# EAGLE design Mother_Board (EAGLE 7.5.0)
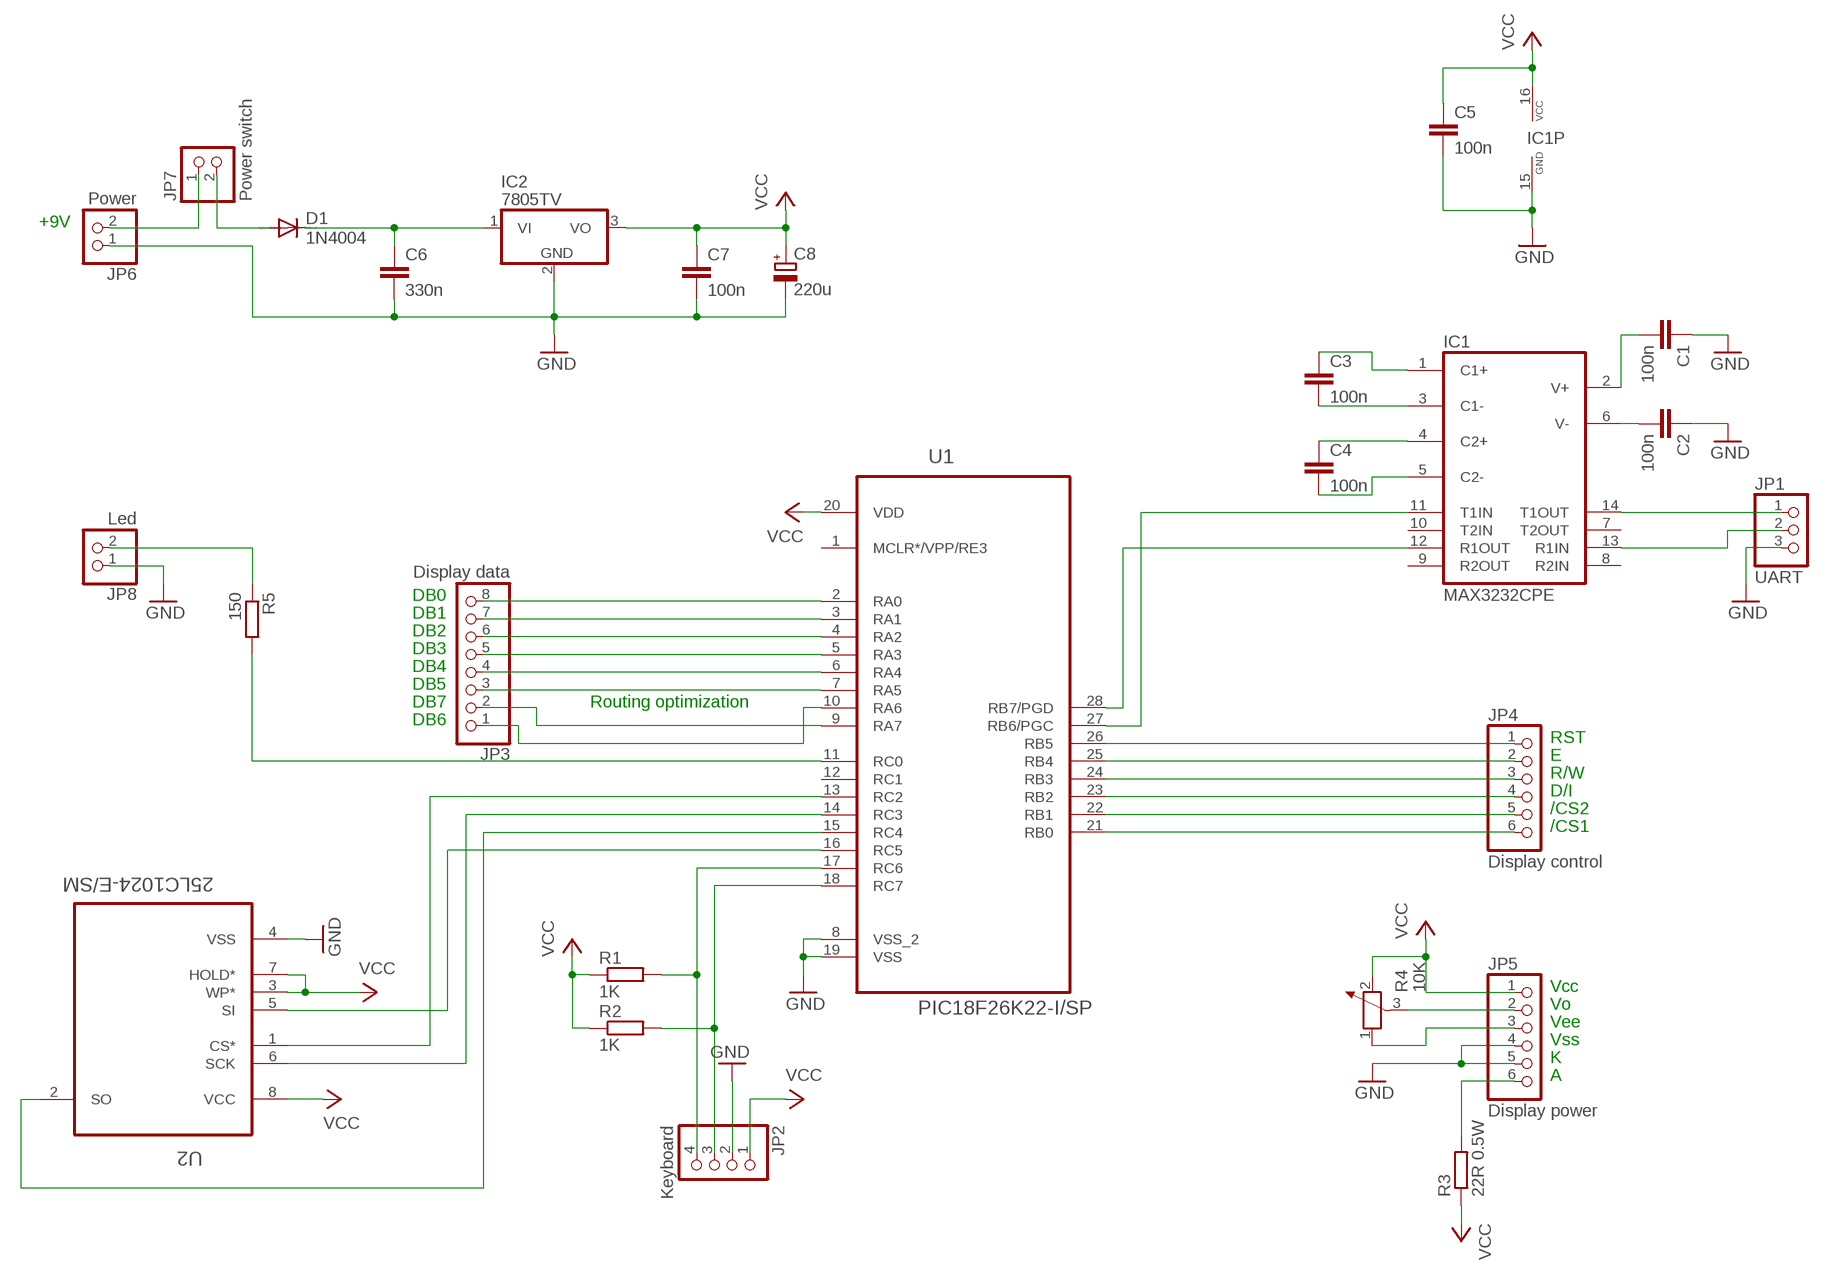
[diagram p0: schematic, sheet 1]

## Parts
C1  100n  C-EU025-030X050  [C025-030X050]
C2  100n  C-EU025-030X050  [C025-030X050]
C3  100n  C-EU025-030X050  [C025-030X050]
C4  100n  C-EU025-030X050  [C025-030X050]
C5  100n  C-EU025-030X050  [C025-030X050]
C6  330n  C-EU025-050X050  [C025-050X050]
C7  100n  C-EU025-030X050  [C025-030X050]
C8  220u  CPOL-EUB45181A  [B45181A]
D1  1N4004  [DO41-10]
IC1  MAX3232CPE  [DIL16]
IC2  7805TV  [TO220V]
JP1  UART  PINHD-1X3  [1X03]
JP2  Keyboard  PINHD-1X4  [1X04]
JP3  Display data  PINHD-1X8  [1X08]
JP4  Display control  PINHD-1X6  [1X06]
JP5  Display power  PINHD-1X6  [1X06]
JP6  Power  PINHD-1X2  [1X02]
JP7  Power switch  PINHD-1X2  [1X02]
JP8  Led  PINHD-1X2  [1X02]
R1  1K  R-EU_0207/10  [0207/10]
R2  1K  R-EU_0207/10  [0207/10]
R3  22R 0.5W  R-EU_0207/10  [0207/10]
R4  10K  POTENTIOMETER_PT-10S  [PT-10S]
R5  150  R-EU_0207/10  [0207/10]
U1  PIC18F26K22-I/SP  [DIP254P762X508-28P]
U2  25LC1024-E/SM  [SOIC127P794X203-8N]

## Nets
GND: C1.1 C2.1 C5.2 C6.2 C7.2 C8.- IC1.15(GND) IC2.2(GND) JP1.3 JP2.2 JP5.4 JP5.5 JP6.1 JP8.1 U1.8(VSS_2) U1.19(VSS) U2.4(VSS)
N$1: C3.1 IC1.1(C1+)
N$2: C3.2 IC1.3(C1-)
N$3: C4.1 IC1.4(C2+)
N$4: C4.2 IC1.5(C2-)
N$5: C1.2 IC1.2(V+)
N$6: IC1.12(R1OUT) U1.28(RB7/PGD)
N$7: C2.2 IC1.6(V-)
N$8: IC1.11(T1IN) U1.27(RB6/PGC)
N$9: IC1.14(T1OUT) JP1.1
N$10: IC1.13(R1IN) JP1.2
N$11: JP3.8 U1.2(RA0)
N$12: JP3.7 U1.3(RA1)
N$13: JP2.3 R2.2 U1.18(RC7)
N$14: JP2.4 R1.2 U1.17(RC6)
N$15: JP3.6 U1.4(RA2)
N$16: JP3.5 U1.5(RA3)
N$17: JP3.4 U1.6(RA4)
N$18: JP3.3 U1.7(RA5)
N$19: JP3.2 U1.9(RA7)
N$20: JP3.1 U1.10(RA6)
N$21: U1.16(RC5) U2.5(SI)
N$22: U1.14(RC3) U2.6(SCK)
N$23: U1.15(RC4) U2.2(SO)
N$24: U1.13(RC2) U2.1(CS*)
N$25: JP5.3 R4.1
N$26: JP4.1 U1.26(RB5)
N$27: JP4.2 U1.25(RB4)
N$28: JP4.3 U1.24(RB3)
N$29: JP4.4 U1.23(RB2)
N$30: JP4.5 U1.22(RB1)
N$31: JP4.6 U1.21(RB0)
N$32: JP5.2 R4.3
N$33: JP5.6 R3.2
N$34: JP6.2 JP7.1
N$35: D1.A JP7.2
N$36: C6.1 D1.C IC2.1(VI)
N$37: R5.2 U1.11(RC0)
N$38: JP8.2 R5.1
VCC: C5.1 C7.1 C8.+ IC1.16(VCC) IC2.3(VO) JP2.1 JP5.1 R1.1 R2.1 R3.1 R4.2 U1.20(VDD) U2.3(WP*) U2.7(HOLD*) U2.8(VCC)
Unconnected: IC1.7(T2OUT) IC1.8(R2IN) IC1.9(R2OUT) IC1.10(T2IN) U1.1(MCLR*/VPP/RE3) U1.12(RC1)

## Notes on the sheet
- +9V
- DB0
- DB1
- DB2
- DB3
- DB4
- DB5
- DB7 | Routing optimization
- DB6
- RST
- E
- R/W
- D/I
- /CS2
- /CS1
- Vcc
- Vo
- Vee
- Vss
- K
- A

## Library data of the parts
C1-C7 = rcl:C-EU: CAPACITOR, European symbol
C8 = rcl:CPOL-EU: POLARIZED CAPACITOR, European symbol
D1 = diode:1N4004: DIODE general purpose rectifier, 1 A
IC1 = maxim:MAX3232*: True RS-232 Transceivers 3.0V to 5.5V, Low-Power up to 1Mbps, Using Four 0.1µF External Capacitors Source: http://pdfserv.maxim-ic.com/en/ds/MAX3222-MAX3241.pdf; MF: MAXIM; MPN: MAX3232CPE+; OC_FARNELL: 9724494; OC_NEWARK: 68K4626
IC2 = linear:78*: Positive VOLTAGE REGULATOR Source: http://cache.national.com/ds/LM/LM78L05.pdf http://www.fairchildsemi.com/ds/LM/LM7805.pdf
JP1 = pinhead:PINHD-1X3: PIN HEADER
JP2 = pinhead:PINHD-1X4: PIN HEADER
JP3 = pinhead:PINHD-1X8: PIN HEADER
JP4 JP5 = pinhead:PINHD-1X6: PIN HEADER
JP6-JP8 = pinhead:PINHD-1X2: PIN HEADER
R1 R2 R5 = rcl:R-EU_: RESISTOR, European symbol
R3 = resistor:R-EU_: RESISTOR, European symbol
R4 = rcl:POTENTIOMETER_: Potentiometer
U1 = PIC18F26K22:PIC18F26K22-I/SP: MCU, 8BIT, 64K FLASH, XLP, SPDIP-28; MPN: PIC18F26K22-I/SP; OC_FARNELL: 1814975; OC_NEWARK: 65T6686; PACKAGE: SPDIP-28; SUPPLIER: MICROCHIP
U2 = 25LC1024:25LC1024-E/SM: IC EEPROM 1MBIT 20MHZ ,SOIC-8; MPN: 25LC1024-E/SM; OC_FARNELL: 2098001; OC_NEWARK: 89H3174; PACKAGE: SOIJ-8; SUPPLIER: Microchip

## Board
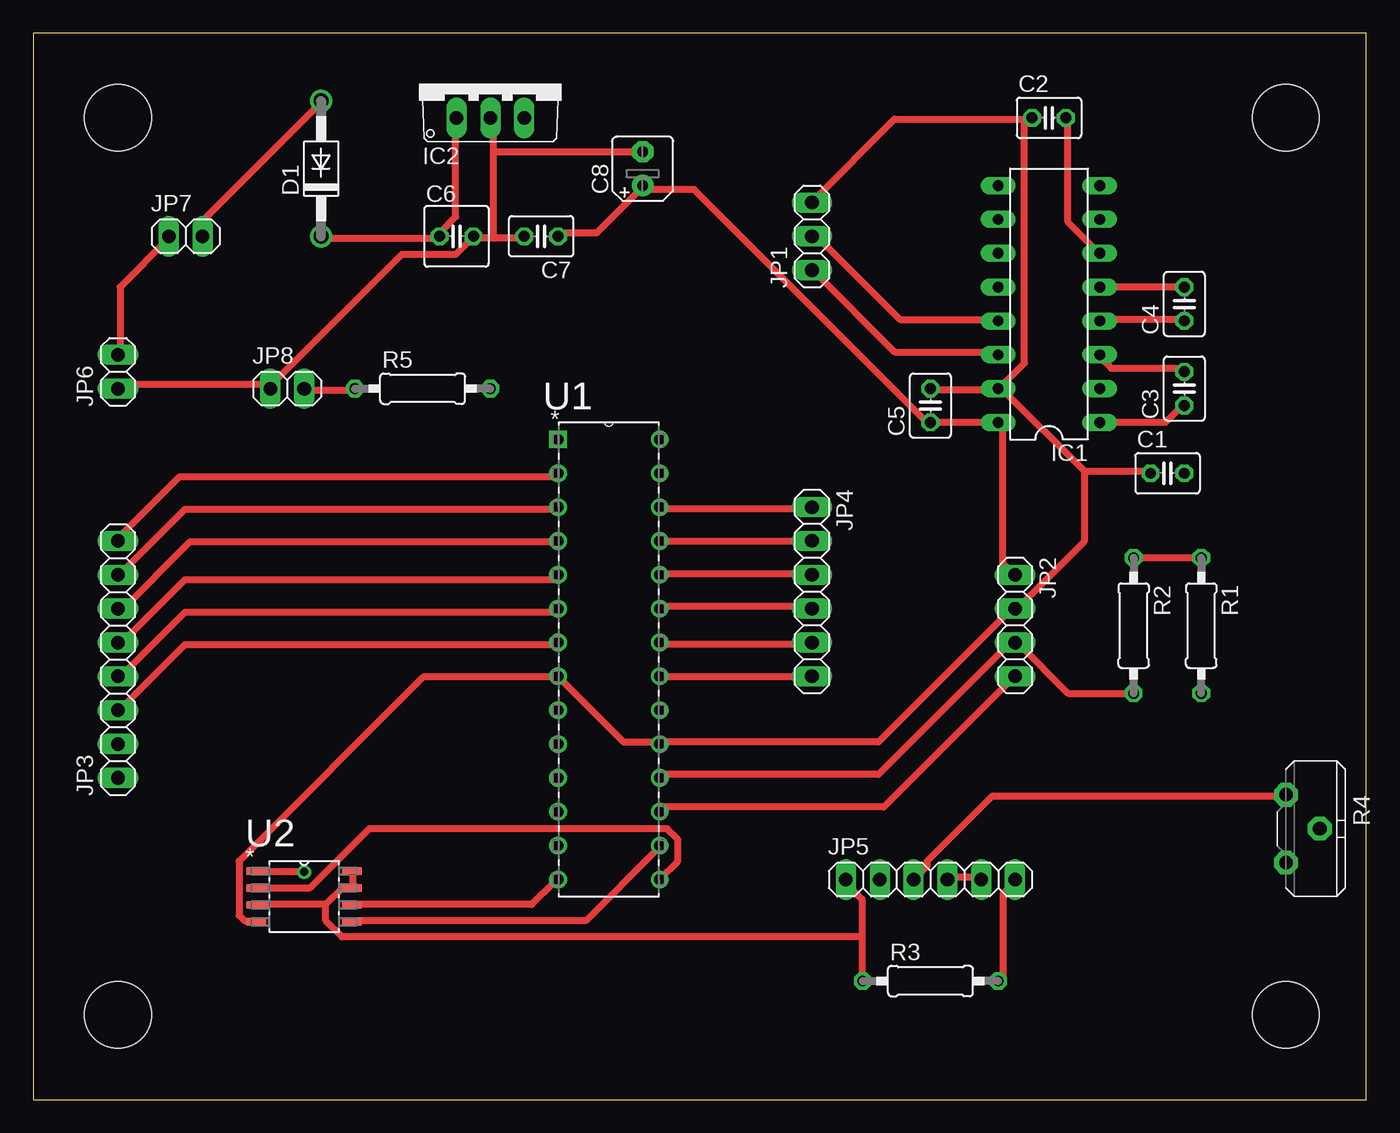
[diagram p1: board, top side]
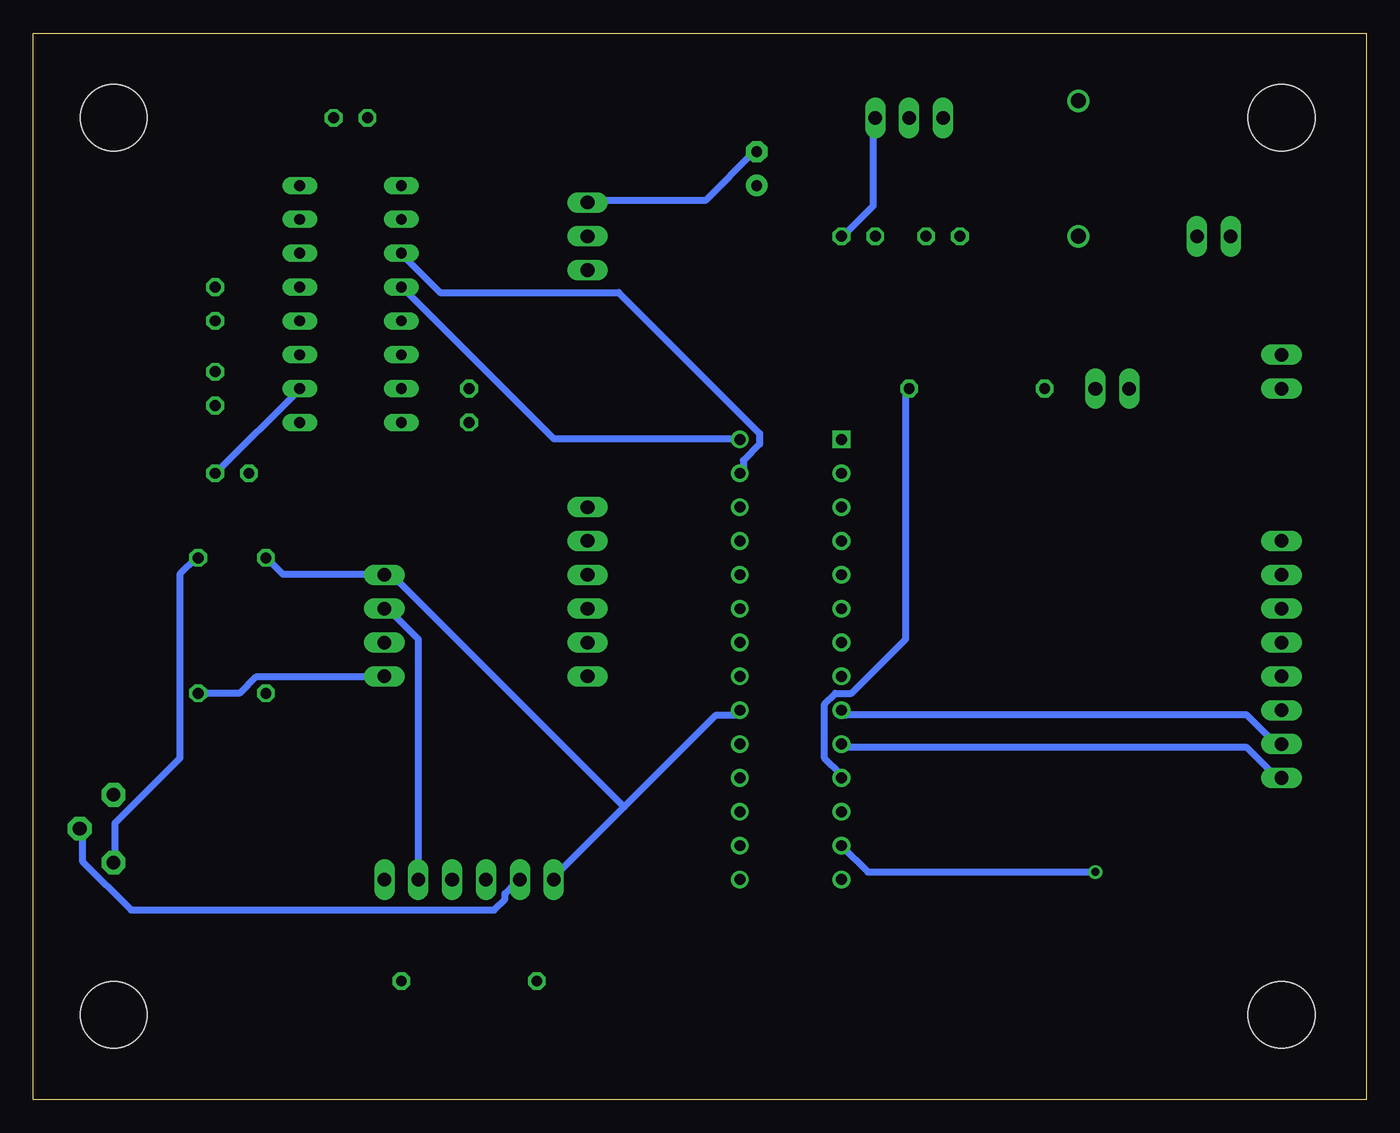
[diagram p2: board, bottom side, seen from below]

Size 100 x 80 mm. Coordinates in mm from the lower left corner, seen from the top.
Outline: 0,0 100,0 100,80 0,80 0,0
Copper layers (1*16): Top 0.035mm / dielectric 1.5mm / Bottom 0.035mm
Design rules "default *": minimum track width 20mil, minimum drill 24mil, track to track 12mil, track to pad 12mil, pad to pad 12mil, via to via 12mil, smd to smd 12mil, copper to edge 60mil, drill to drill 16mil, minimum pad ring 10mil, minimum via ring 8mil, stop-mask expansion 4mil, vias tented up to drill 0mil, thermal gap 10mil
Holes 5 mm at 6.35,73.66 93.98,73.66 93.98,6.35 6.35,6.35

### Footprints (pad centres in the part's own frame; a part is rotated, then mirrored left to right if it is on the bottom)
C025-030X050 = drill 0.813 octagon: 1 -1.27,0; 2 1.27,0
C025-050X050 = drill 0.813 octagon: 1 -1.27,0; 2 1.27,0
B45181A = drill 0.813 pad 1.6: + -1.27,0 | drill 0.813 pad 1.6 octagon: - 1.27,0
DO41-10 = drill 1.118: A 5.08,0; C -5.08,0
DIL16 = drill 0.813 long: 1 -8.89,-3.81; 2 -6.35,-3.81; 3 -3.81,-3.81; 4 -1.27,-3.81; 5 1.27,-3.81; 6 3.81,-3.81; 7 6.35,-3.81; 8 8.89,-3.81; 9 8.89,3.81; 10 6.35,3.81; 11 3.81,3.81; 12 1.27,3.81; 13 -1.27,3.81; 14 -3.81,3.81; 15 -6.35,3.81; 16 -8.89,3.81
TO220V = drill 1.016 long: 1 -2.54,-2.54; 2 0,-2.54; 3 2.54,-2.54
1X03 = drill 1.016 long: 1 -2.54,0; 2 0,0; 3 2.54,0
1X04 = drill 1.016 long: 1 -3.81,0; 2 -1.27,0; 3 1.27,0; 4 3.81,0
1X08 = drill 1.016 long: 1 -8.89,0; 2 -6.35,0; 3 -3.81,0; 4 -1.27,0; 5 1.27,0; 6 3.81,0; 7 6.35,0; 8 8.89,0
1X06 = drill 1.016 long: 1 -6.35,0; 2 -3.81,0; 3 -1.27,0; 4 1.27,0; 5 3.81,0; 6 6.35,0
1X02 = drill 1.016 long: 1 -1.27,0; 2 1.27,0
0207/10 = drill 0.813 octagon: 1 -5.08,0; 2 5.08,0
PT-10S = drill 1.016 pad 1.778 octagon: 1 -2.54,-1.27; 2 2.54,-1.27; 3 0,1.27
DIP254P762X508-28P = drill 0.813 square: 1 -7.62,33.02 | drill 0.813: 2 -7.62,30.48; 3 -7.62,27.94; 4 -7.62,25.4; 5 -7.62,22.86; 6 -7.62,20.32; 7 -7.62,17.78; 8 -7.62,15.24; 9 -7.62,12.7; 10 -7.62,10.16; 11 -7.62,7.62; 12 -7.62,5.08; 13 -7.62,2.54; 14 -7.62,0; 15 0,0; 16 0,2.54; 17 0,5.08; 18 0,7.62; 19 0,10.16; 20 0,12.7; 21 0,15.24; 22 0,17.78; 23 0,20.32; 24 0,22.86; 25 0,25.4; 26 0,27.94; 27 0,30.48; 28 0,33.02
SOIC127P794X203-8N = smd 1.473 x 0.559: 1 -3.581,1.905; 2 -3.581,0.635; 3 -3.581,-0.635; 4 -3.581,-1.905; 5 3.581,-1.905; 6 3.581,-0.635; 7 3.581,0.635; 8 3.581,1.905

### Placement (x,y rotation side)
C1  85.09,46.99 0 top
C2  76.2,73.66 0 top
C3  86.36,53.34 90 top
C4  86.36,59.69 90 top
C5  67.31,52.07 90 top
C6  31.75,64.77 0 top
C7  38.1,64.77 180 top
C8  45.72,69.85 90 top
D1  21.59,69.85 90 top
IC1  76.2,59.69 90 top
IC2  34.29,76.2 0 top
JP1  58.42,64.77 90 top
JP2  73.66,35.56 270 top
JP3  6.35,33.02 90 top
JP4  58.42,38.1 270 top
JP5  67.31,16.51 0 top
JP6  6.35,54.61 90 top
JP7  11.43,64.77 0 top
JP8  19.05,53.34 0 top
R1  87.63,35.56 270 top
R2  82.55,35.56 270 top
R3  67.31,8.89 0 top
R4  95.25,20.32 270 top
R5  29.21,53.34 0 top
U1  46.99,16.51 0 top
U2  20.32,15.24 0 top

### Tracks (layer width: path | path; a pad name or v marks a point on that pad's centre or on a via)
GND
  Top 0.508: 74.37,73.56 64.62,73.56 58.52,67.46 JP1.3 | 74.37,73.56 74.78,73.56 C2.1 74.37,73.56 | JP6.1 6.5,53.65 17.48,53.65 JP8.1 17.88,53.65 27.64,63.4 31.7,63.4 32.92,64.62 C6.2 33.33,64.62 34.54,64.62 | 34.54,64.62 36.58,64.62 C7.2 | 34.54,64.62 34.54,71.12 | 34.54,71.12 34.54,73.56 IC2.2 | 34.54,71.12 C8.- | U2.4 16.66,13.41 15.85,13.41 15.44,13.82 15.44,17.88 29.26,31.7 39.01,31.7 U1.8 44.3,26.82 46.74,26.82 U1.19 47.14,26.82 63.4,26.82 73.56,36.98 JP2.2 73.97,36.98 78.84,41.86 78.84,47.14 | JP5.4 68.68,16.66 71.12,16.66 JP5.5 | C5.2 67.46,53.24 72.34,53.24 IC1.15 | 78.84,47.14 83.72,47.14 C1.1 | 78.84,47.14 72.75,53.24 IC1.15 | 74.37,73.56 74.37,55.27 72.75,53.65 IC1.15
  Bottom 0.508: JP1.3 58.12,67.46 49.58,67.46 45.92,71.12 C8.- | JP5.5 71.12,34.54 73.56,36.98 JP2.2
N$1
  Top 0.508: IC1.1 84.94,50.8 86.16,52.02 C3.1
N$2
  Top 0.508: C3.2 86.16,54.86 80.87,54.86 80.06,55.68 IC1.3
N$3
  Top 0.508: IC1.4 80.06,58.52 86.16,58.52 C4.1
N$4
  Top 0.508: C4.2 IC1.5
N$5
  Bottom 0.508: IC1.2 80.06,53.24 86.16,47.14 C1.2
N$6
  Bottom 0.508: U1.28 47.14,49.58 60.96,49.58 72.34,60.96 IC1.12
N$7
  Top 0.508: C2.2 77.62,73.56 77.62,65.84 79.65,63.8 IC1.6
N$8
  Bottom 0.508: U1.27 46.74,47.14 46.74,47.95 45.52,49.17 45.52,49.99 56.08,60.55 69.49,60.55 72.34,63.4 IC1.11
N$9
  Top 0.508: IC1.14 72.34,56.08 64.62,56.08 58.52,62.18 JP1.1
N$10
  Top 0.508: IC1.13 72.34,58.52 65.02,58.52 58.52,65.02 JP1.2
N$11
  Top 0.508: U1.2 39.01,46.74 10.97,46.74 6.5,42.27 JP3.8
N$12
  Top 0.508: U1.3 39.01,44.3 11.38,44.3 6.5,39.42 JP3.7
N$13
  Top 0.508: U1.18 47.14,24.38 63.4,24.38 73.56,34.54 JP2.3 73.97,34.14 77.62,30.48 R2.2
N$14
  Top 0.508: U1.17 47.14,21.95 63.8,21.95 73.56,31.7 JP2.4
  Bottom 0.508: R1.2 84.53,30.48 83.31,31.7 73.97,31.7 JP2.4
N$15
  Top 0.508: U1.4 39.01,41.86 11.79,41.86 6.5,36.58 JP3.6
N$16
  Top 0.508: U1.5 39.01,39.01 11.38,39.01 6.5,34.14 JP3.5
N$17
  Top 0.508: U1.6 39.01,36.58 11.38,36.58 6.5,31.7 JP3.4
N$18
  Top 0.508: U1.7 39.01,34.14 11.38,34.14 6.5,29.26 JP3.3
N$19
  Bottom 0.508: U1.9 39.01,28.85 8.94,28.85 6.5,26.42 JP3.2
N$20
  Bottom 0.508: U1.10 39.01,26.42 8.94,26.42 6.5,23.98 JP3.1
N$21
  Top 0.508: U2.5 23.98,13.41 41.45,13.41 46.74,18.69 U1.16
N$22
  Top 0.508: U2.6 23.98,14.63 37.39,14.63 39.01,16.26 U1.14
N$23
  Top 0.508: U1.15 48.36,17.88 48.36,19.51 47.55,20.32 25.2,20.32 20.73,15.85 17.07,15.85 U2.2
N$24  (via drill 0.61)
  Top 0.508: v20.32,17.07 17.07,17.07 U2.1
  Bottom 0.508: v20.32,17.07 37.39,17.07 U1.13
N$25
  Top 0.508: JP5.3 66.24,16.66 67.06,17.48 67.06,17.88 71.93,22.76 93.88,22.76 R4.1
N$26
  Top 0.508: U1.26 47.14,44.3 58.12,44.3 JP4.1
N$27
  Top 0.508: U1.25 47.14,41.86 58.12,41.86 JP4.2
N$28
  Top 0.508: U1.24 47.14,39.42 58.12,39.42 JP4.3
N$29
  Top 0.508: U1.23 47.14,36.98 58.12,36.98 JP4.4
N$30
  Top 0.508: U1.22 47.14,34.14 58.12,34.14 JP4.5
N$31
  Top 0.508: U1.21 47.14,31.7 58.12,31.7 JP4.6
N$32
  Bottom 0.508: JP5.2 63.8,16.26 64.62,15.44 64.62,15.04 65.43,14.22 92.66,14.22 96.32,17.88 96.32,20.32 R4.3
N$33
  Top 0.508: R3.2 72.75,8.94 72.75,15.44 73.56,16.26 JP5.6
N$34
  Top 0.508: JP6.2 6.5,56.08 6.5,60.96 10.16,64.62 JP7.1
N$35
  Top 0.508: JP7.2 13.01,65.02 13.01,66.24 21.54,74.78 D1.A
N$36
  Top 0.508: D1.C 21.95,64.62 30.48,64.62 C6.1 30.48,65.02 31.7,66.24 31.7,73.56 IC2.1
N$37
  Bottom 0.508: R5.2 34.54,53.24 34.54,34.54 38.61,30.48 39.83,30.48 40.64,29.67 40.64,25.6 39.42,24.38 U1.11
N$38
  Top 0.508: R5.1 23.98,53.24 20.32,53.24 JP8.2
VCC
  Top 0.508: 21.95,14.63 17.07,14.63 U2.3 | 21.95,14.63 23.16,15.85 23.57,15.85 U2.7 23.98,15.85 23.98,17.07 U2.8 | 62.18,12.19 62.18,15.04 60.96,16.26 JP5.1 | 62.18,12.19 62.18,8.94 R3.1 | 21.95,14.63 21.95,13.41 23.16,12.19 62.18,12.19 | C7.1 39.42,65.02 42.27,65.02 45.52,68.28 C8.+ 45.92,68.28 49.58,68.28 67.06,50.8 C5.1 IC1.16 72.75,50.8 72.75,40.23 73.56,39.42 JP2.1 | R1.1 R2.1
  Bottom 0.508: 55.68,21.95 60.96,16.66 JP5.1 | 55.68,21.95 48.77,28.85 47.14,28.85 U1.20 | IC2.3 36.98,73.56 36.98,67.06 39.01,65.02 C7.1 | R2.1 82.5,40.64 81.28,39.42 73.97,39.42 JP2.1 73.56,39.01 72.75,39.01 55.68,21.95 | R4.2 93.88,17.88 93.88,20.73 89,25.6 89,39.42 87.78,40.64 R1.1